# Altium schematic sheet Power.SchDoc
size A4; DocumentNumber: 4; SheetNumber: 4; SheetTotal: 5
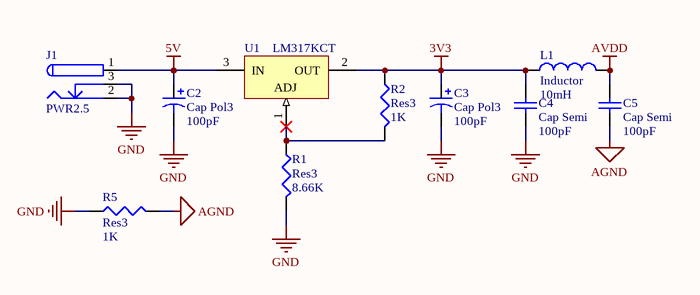
[diagram p0: Power.SchDoc]

## Parts
C2  Cap Pol3  value 100pF  [CASE-A_3216]
C3  Cap Pol3  value 100pF  [CASE-A_3216]
C4  Cap Semi  value 100pF  [0603_C]
C5  Cap Semi  value 100pF  [0603_C]
J1  PWR2.5  [DC005F]
L1  Inductor  value 10mH  [0603_L]
R1  Res3  value 8.66K  [0603_R]
R2  Res3  value 1K  [0603_R]
R5  Res3  value 1K  [0603_R]
U1  LM317KCT  [TO-220(TO-220-3)]

## Nets
3V3: C3.1 C4.2 L1.1 R2.1 U1.2(OUT)
5V: C2.1 J1.1 U1.3(IN)
AGND: C5.1 R5.2
AVDD: C5.2 L1.2
GND: C2.2 C3.2 C4.1 J1.2 J1.3 R1.2 R5.1
NetR1_1: R1.1 R2.2 U1.1(ADJ)

## Library data of the parts
C2 C3 = Cap Pol3: Polarized Capacitor (Surface Mount); Published: 8-Jun-2000; LatestRevisionDate: 29-May-2009; LatestRevisionNote: IPC-7351 Footprint Added.; PackageReference: C0805; Publisher: Altium Limited; PackageDescription: Chip Capacitor
C4 C5 = Cap Semi: Capacitor (Semiconductor SIM Model); Published: 8-Jun-2000; LatestRevisionDate: 29-May-2009; LatestRevisionNote: IPC-7351 Footprint Added.; PackageReference: C1206; Publisher: Altium Limited; PackageDescription: Chip Capacitor
J1 = PWR2.5: Low Voltage Power Supply Connector; Published: 17-Dec-2003; DatasheetDocument: 09-May-2002; Publisher: Altium Limited; ComponentLink1Description: Manufacturer Link; ComponentLink1URL: http://domino.kycon.com/internet/Products.html
L1 = Inductor: Code_IEC: 1005; Published: 8-Jun-2000; LatestRevisionDate: 29-May-2009; LatestRevisionNote: IPC-7351 Footprint Added.; PackageReference: 0402-A; Publisher: Altium Limited; PackageDescription: Chip Inductor; Code_JEITA: 0402
R1 R2 R5 = Res3: Resistor; Published: 8-Jun-2000; LatestRevisionDate: 29-May-2009; LatestRevisionNote: IPC-7351 Footprint Added.; PackageReference: J1-0603; Publisher: Altium Limited; PackageDescription: Chip Resistor
U1 = LM317KC: 3-Terminal Adjustable Regulator; Note: Pin 2 is electrically connected to tab; Published: 15-Apr-2002; DatasheetVersion: Feb-1988; PackageVersion: Sep-1995; PackageReference: KC03; Publisher: Altium Limited; PackageDescription: TO, Thru-Hole, Vertical, Heatsink Mounted; 3 In-Line Leads; Pitch 2.54 mm; ComponentLink1Description: Manufacturer Link; ComponentLink1URL: http://www.ti.com/